# Altium schematic sheet 1_P1.schdoc.schdoc
size 309 x 223 mm; Symbol: Sheet-Symbol_A4; Device: Sheet-Symbol_A4; Company: 嘉立创EDA; Drawed: 吴登珂; Version: V1.0; Page Size: A4; @Project Name: Test1.3; @Page Count: 1; @Update Date: 2024-03-24; @Create Date: 2024-03-20; @Schematic Name: Schematic1; @Page No: 1; @Page Name: P1
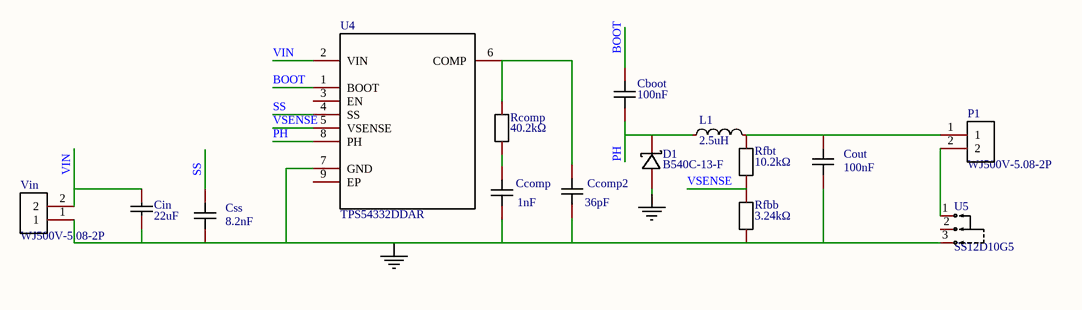
[diagram p0: 1_P1.schdoc.schdoc]

## Parts
Cboot  100nF  [C0402]
Ccomp  1nF  [C0201]
Ccomp2  36pF  [C0201]
Cin  22uF  [C1210]
Cout  100nF  [C2220]
Css  8.2nF  [C2220]
D1  B540C-13-F  [SMC_L7.1-W6.2-LS8.1-RD]
L1  2.5uH  [L0603]
P1  WJ500V-5.08-2P  [CONN-TH_2P-P5.00_WJ500V-5.08-2P]
Rcomp  40.2kΩ  [R0402]
Rfbb  3.24kΩ  [R0402]
Rfbt  10.2kΩ  [R0402]
U4  TPS54332DDAR  [SOP-8_L4.9-W3.9-P1.27-LS6.0-BL-EP-1]
U5  SS12D10G5  [SW-TH_SHOU-HAN_SS12D10G4]
Vin  WJ500V-5.08-2P  [CONN-TH_2P-P5.00_WJ500V-5.08-2P]

## Nets
NetCcomp_1: Ccomp.1 Ccomp2.1 Cin.1 Cout.1 Css.1 D1.2(A) Rfbb.1 U4.7(GND) U5.3 Vin.1
BOOT: Cboot.2 U4.1(BOOT)
PH: Cboot.1 D1.1(K) L1.1 U4.8(PH)
SS: Css.2 U4.4(SS)
VIN: Cin.2 U4.2(VIN) Vin.2
VSENSE: Rfbb.2 Rfbt.1 U4.5(VSENSE)
NetCcomp2_2: Ccomp2.2 Rcomp.2 U4.6(COMP)
NetCcomp_2: Ccomp.2 Rcomp.1
NetCout_2: Cout.2 L1.2 P1.1 Rfbt.2
NetP1_2: P1.2 U5.1

Not connected (* = marked no-connect by the designer): U4 3(EN) 9(EP); U5 2

## Notes on the sheet
- 1
- 2
- 3
- 4
- 5
- 6
- A
- B
- C
- 原理图
- Schematic1
- 创建日期
- 更新日期
- 2024-03-24
- 2024-03-20
- 审阅
- 绘制
- 图页
- 吴登珂
- P1
- 物料编码
- Test1.3
- D
- 版本
- 尺寸
- 页
- 共
- V1.0
- A4
- 嘉立创EDA

## Library data of the parts
Cboot = GRM155R71A104KA01D: Manufacturer: muRata(村田); Add into BOM: yes; Tolerance: ±10%; Voltage Rated: 10V; Temperature Coefficient: X7R; Description: 容值:100nF;精度:±10%;额定电压:10V;材质(温度系数):X7R;; Name: 100nF; Symbol: GRM155R71A104KA01D; Device: GRM155R71A104KA01D; LCSC Part Name: 100nF ±10% 10V; Supplier Part: C71687; Manufacturer Part: GRM155R71A104KA01D; Supplier Footprint: 0402; JLCPCB Part Class: 扩展库; Datasheet: https://atta.szlcsc.com/upload/public/pdf/source/20180228/C71687_15198055953951377607.pdf; Supplier: LCSC; Convert to PCB: yes; Value: 100nF
Ccomp Ccomp2 = GRM0335C1H360GA01D: Manufacturer: muRata(村田); Add into BOM: yes; Tolerance: ±2%; Voltage Rated: 50V; Temperature Coefficient: C0G; Description: 容值:36pF;精度:±2%;额定电压:50V;材质(温度系数):C0G;; Symbol: GRM0335C1H360GA01D; Device: GRM0335C1H360GA01D; Supplier: LCSC; Supplier Part: C384983; Manufacturer Part: GRM0335C1H360GA01D; LCSC Part Name: 36pF ±2% 50V; Supplier Footprint: 0201; JLCPCB Part Class: Extended Part; Datasheet: https://atta.szlcsc.com/upload/public/pdf/source/20200305/C490387_23319AE8C154DEB24C505E6C82A8106A.pdf; Convert to PCB: yes
  Ccomp: Name: 1nF; Value: 1nF
  Ccomp2: Name: 36pF; Value: 36pF
Cin = GRM32ER61E226KE15L: Manufacturer: muRata(村田); Add into BOM: yes; Tolerance: ±10%; Voltage Rated: 25V; Temperature Coefficient: X5R; Description: 容值:22uF;精度:±10%;额定电压:25V;材质(温度系数):X5R;; Name: 22uF; Symbol: GRM32ER61E226KE15L; Device: GRM32ER61E226KE15L; Supplier: LCSC; Manufacturer Part: GRM32ER61E226KE15L; Value: 22uF; Supplier Part: C65428; JLCPCB Part Class: 扩展库; LCSC Part Name: 22uF ±10% 25V; Supplier Footprint: 1210; Datasheet: https://atta.szlcsc.com/upload/public/pdf/source/20161108/1478586380821.pdf; Convert to PCB: yes
Cout Css = FE2HX476M500LGL: Manufacturer: PSA(信昌电陶); Add into BOM: yes; Tolerance: ±20%; Rated Voltage: 50V; Temperature Coefficient: X7R; Description: 容值:47uF;精度:±20%;额定电压:50V;温度系数:X7R;; Symbol: FE2HX476M500LGL; Device: FE2HX476M500LGL; LCSC Part Name: FE2HX476M500LGL; Supplier Part: C5447693; Manufacturer Part: FE2HX476M500LGL; Supplier Footprint: 2220; Supplier: LCSC; Convert to PCB: yes
  Cout: Name: 100nF; Value: 100nF
  Css: Name: 8.2nF; Value: 8.2nF
D1 = B540C-13-F: Manufacturer: DIODES(美台); Add into BOM: yes; Forward Voltage (Vf@If): 550mV@5A; Reverse Voltage (Vr): 40V; Average Rectified Current (Io): 5A; Reverse Leakage Current (Ir): 500uA@40V; Description: 正向压降(Vf):550mV@5A;直流反向耐压(Vr):40V;平均整流电流(Io):5A;; Name: B540C-13-F; Symbol: B540C-13-F; Device: B540C-13-F; LCSC Part Name: 电压:40V 电流:5A; Supplier Part: C72264; Manufacturer Part: B540C-13-F; Supplier Footprint: SMC(DO-214AB); JLCPCB Part Class: 扩展库; Datasheet: https://atta.szlcsc.com/upload/public/pdf/source/20171023/C134461_15087453602301052556.pdf; Supplier: LCSC; Convert to PCB: yes
L1 = L_0603: Symbol: SDFL1608S100KTF; Add into BOM: yes; Name: 2.5uH; Device: L_0603; Supplier Footprint: L0603; Convert to PCB: yes; Value: 2.5uH
P1 Vin = WJ500V-5.08-2P: Manufacturer: KANGNEX(康奈克斯电气); Symbol: WJ500V-5.08-2P-14-00A; Add into BOM: yes; Structure: 1x2P; Pitch: 5.08mm; Current Rating (Max): 18A; Voltage Rating (Max): 250V; Wire Gauge - AWG: 14~30; Wire Gauge - mm2: 2.5; Number of PINs Per Row: 2; Description: 结构:1x2P;间距:5.08mm;颜色:绿色;安装方式:直插;额定电流:18A;额定电压:250V;排数:1;线规 - AWG:14~30;线规 - 平方毫米:2.5;每排PIN数:2;工作温度范围:-40℃~+105℃;; Name: WJ500V-5.08-2P; Device: WJ500V-5.08-2P; Supplier: LCSC; Manufacturer Part: WJ500V-5.08-2P; Supplier Part: C8465; JLCPCB Part Class: 扩展库; LCSC Part Name: 5.08mm 1x2P 排数:1 每排P数:2 直插; Supplier Footprint: 插件,P=5.08mm; Datasheet: https://atta.szlcsc.com/upload/public/pdf/source/20191225/C8465_02D34CE5B5B4A53DF5891601D97FA9F4.pdf; Convert to PCB: yes; Color: 绿色; Mounting Style: 直插; Number of Pins: 2P; Number of Rows: 1; Operating Temperature Range: -40℃~+105℃
Rcomp = CRCW040240K2FKED: Manufacturer: VISHAY(威世); Add into BOM: yes; Tolerance: ±1%; Power(Watts): 63mW; Overload Voltage (Max): 50V; Temperature Coefficient: ±100ppm/K; Description: 电阻类型:厚膜电阻;阻值:40.2kΩ;精度:±1%;功率:63mW;最大工作电压:50V;温度系数:±100ppm/K;; Name: 40.2kΩ; Symbol: CRCW040240K2FKED; Device: CRCW040240K2FKED; LCSC Part Name: 厚膜电阻 40.2kΩ ±1% 63mW; Supplier Part: C844507; Manufacturer Part: CRCW040240K2FKED; Supplier Footprint: 0402; JLCPCB Part Class: Extended Part; Datasheet: https://atta.szlcsc.com/upload/public/pdf/source/20200927/C844919_23E7F5DF28E9421F105631C5C2D28736.pdf; Supplier: LCSC; Convert to PCB: yes; Type: 厚膜电阻; Value: 40.2kΩ; Operating Temperature Range: -55℃~+155℃
Rfbb Rfbt = CRCW040210K2FKED: Manufacturer: VISHAY(威世); Add into BOM: yes; Tolerance: ±1%; Power(Watts): 63mW; Overload Voltage (Max): 75V; Temperature Coefficient: ±100ppm/K; Description: 电阻类型:厚膜电阻;阻值:10.2kΩ;精度:±1%;功率:63mW;最大工作电压:75V;温度系数:±100ppm/K;; Symbol: CRCW040210K2FKED; Device: CRCW040210K2FKED; LCSC Part Name: 厚膜电阻 10.2kΩ ±1% 63mW; Supplier Part: C481923; Manufacturer Part: CRCW040210K2FKED; Supplier Footprint: 0402; JLCPCB Part Class: 扩展库; Datasheet: https://atta.szlcsc.com/upload/public/pdf/source/20200618/C481956_E25174B008CE8C884BEDD7D4D15E674F.pdf; Supplier: LCSC; Convert to PCB: yes; Type: 厚膜电阻; Operating Temperature Range: -55℃~+155℃
  Rfbb: Name: 3.24kΩ; Value: 3.24kΩ
  Rfbt: Name: 10.2kΩ; Value: 10.2kΩ
U4 = TPS54332DDAR: Manufacturer: TI(德州仪器); Add into BOM: yes; Function: 降压型; Output Type: 可调; Input Voltage: 3.5V~28V; Output Voltage: 800mV~26.04V; Output Current (Max): 3.5A; Switching Frequency: 1MHz; Synchronous Rectification: 否; Number of Outputs: 1; Topology: 降压式; Switch tube (built-in/external): 内置; Description: 功能类型:降压型;输出类型:可调;输入电压:3.5V~28V;输出电压:800mV~26.04V;输出电流(最大值):3.5A;; Name: TPS54332DDAR; Symbol: TPS54332DDAR; Device: TPS54332DDAR; Supplier: LCSC; Manufacturer Part: TPS54332DDAR; Supplier Part: C41312; JLCPCB Part Class: 扩展库; LCSC Part Name: TPS54332DDAR; Supplier Footprint: SOP-8-EP; Datasheet: https://www.ti.com/cn/lit/gpn/tps54332; Convert to PCB: yes; Operating Temperature: -40℃~+150℃@(TJ)
U5 = SS12D10G5: Manufacturer: SHOU HAN(首韩); Add into BOM: yes; Circuit: 单刀双掷; Switch Length: 12.7mm; Switch Width: 6.7mm; Current Rating (DC): 2A; Voltage Rating (DC): 125V; Mechanical Life: 3千次; Description: 电路结构:单刀双掷;安装方式:直插;额定电流(DC):2A;额定电压(DC):125V;机械寿命:3千次;; Name: SS12D10G5; Symbol: SS12D10G5; Device: SS12D10G5; LCSC Part Name: 两档立式插件 3脚拨动开关 柄长5.0mm; Supplier Part: C7431054; Manufacturer Part: SS12D10G5; Supplier Footprint: 插件; JLCPCB Part Class: 扩展库; Datasheet: https://atta.szlcsc.com/upload/public/pdf/source/20231130/7A3DB6A149BF0A1DCFFE64FFC07FE434.pdf; Supplier: LCSC; Convert to PCB: yes; Mounting Style: 直插; Operating Temperature: -25℃~+70℃